# Altium schematic sheet 02_FPGA_Clock_Flash.SchDoc
size A
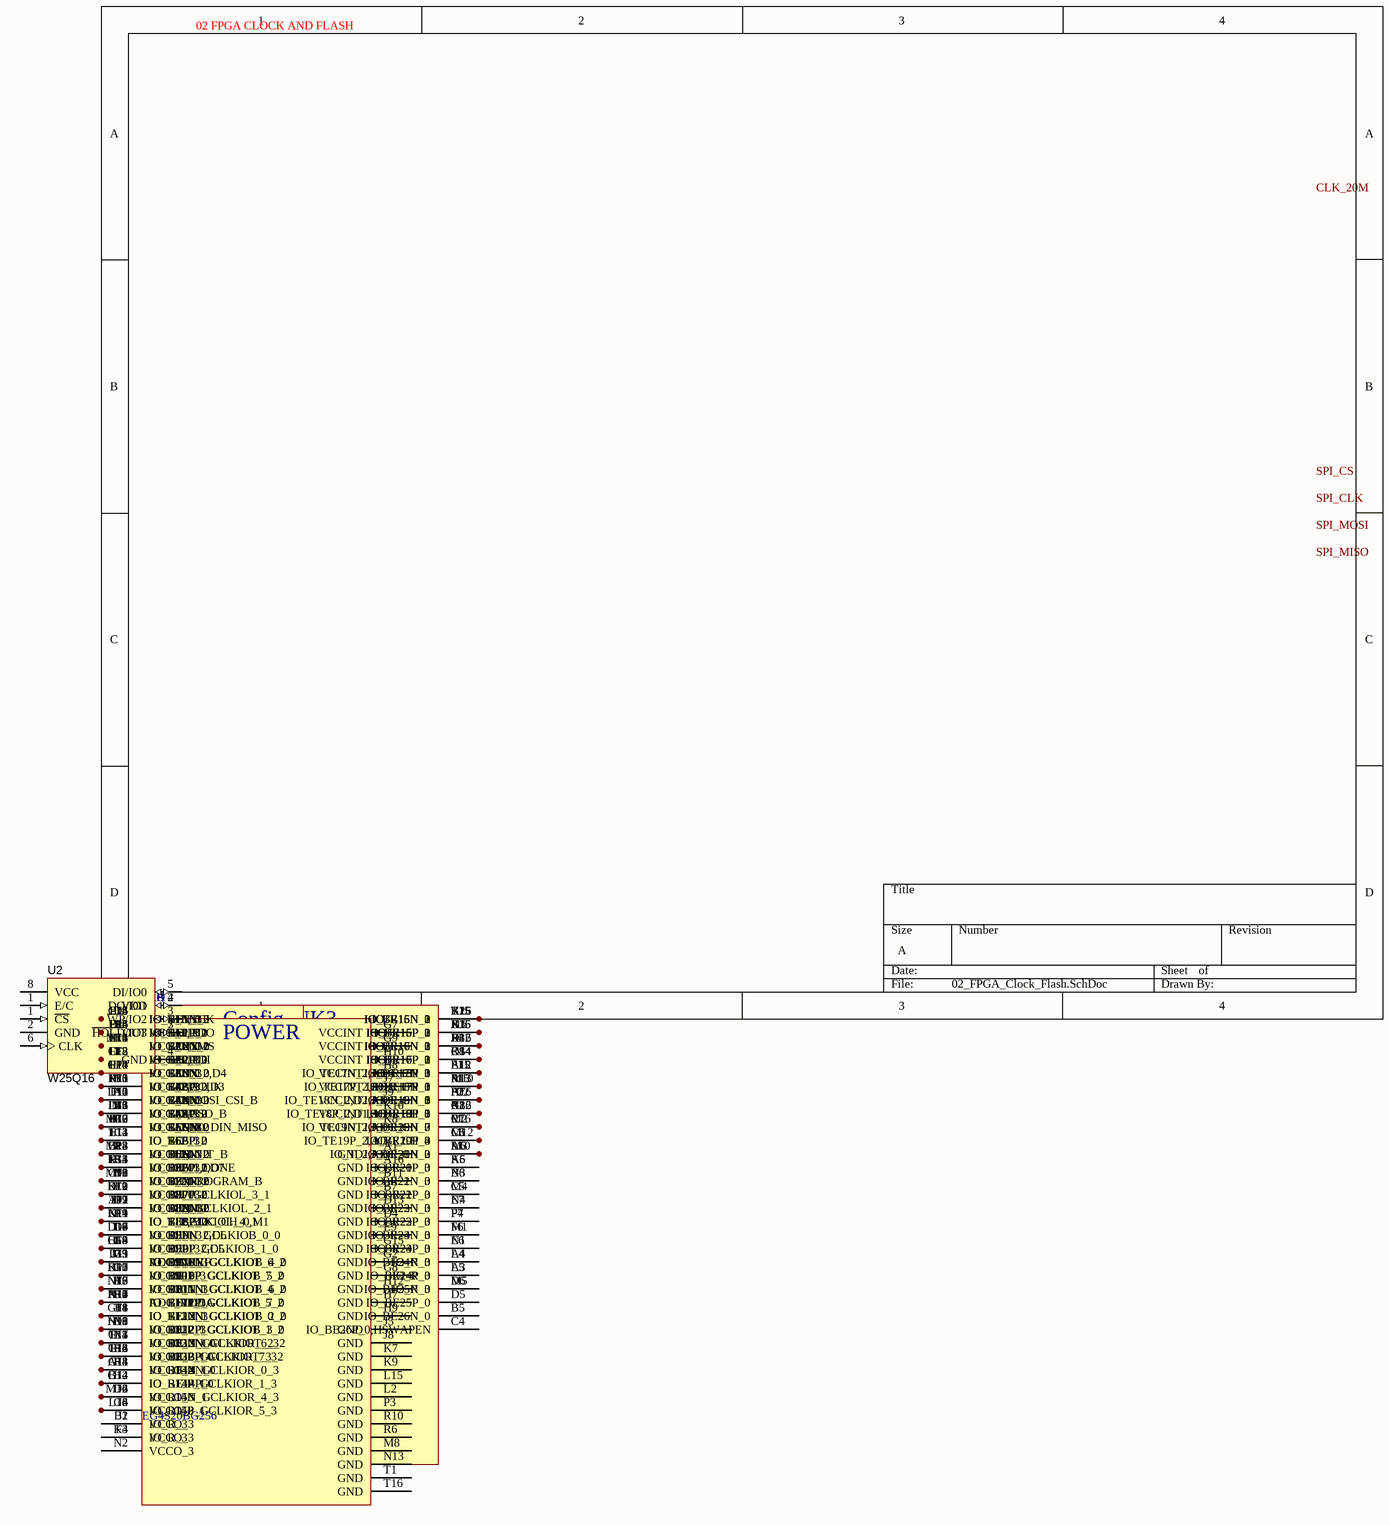
[diagram p0: 02_FPGA_Clock_Flash.SchDoc]

## Parts
U1  EG4S20BG256  [FBGA256]  (parts A,B,C,D,E,F of 6)
U2  W25Q16  [MICT-MW-8_N]
Y1  7X-50.000MBB-T  Frequency: 50MHz  [XTAL_NX3225SA]

## Nets
NetU1_A2: U1.A2(IO_R4N_3) U1.D12(IO_BE4N_0) U1.J10(VCCAUX) U1.J11(IO_L4N_1) U1.N6(IO_TE4N_2) U1.T10(IO_T_2,MOSI_CSI_B)
NetU1_A3: U1.A3(IO_BE24P_0) U1.L5(IO_R_3)
NetU1_A4: U1.A4(IO_BE24N_0) U1.L4(IO_R_3)
NetU1_A5: U1.A5(IO_BE20P_0) U1.K6(IO_R21P_3)
NetU1_A6: U1.A6(IO_BE20N_0) U1.L10(IO_T_2,ADC_CH_2) U1.M3(IO_R21N_3)
NetU1_A7: U1.A7(IO_BE18N_0) U1.H16(IO_L18N_1) U1.P2(IO_R19N_3) U1.P12(IO_TE18N_2,D2,ADC_CH_6)
NetU1_A8: U1.A8(IO_BE18P_0) U1.G16(IO_L18P_1) U1.N12(IO_TE18P_2,D1,ADC_CH_5) U1.R2(IO_R19P_3)
NetU1_A9: U1.A9(IO_BE11N_GCLKIOB_6_0) U1.H5(IO_R11N_3) U1.N15(VCCO_1) U1.N16(IO_L10N_1) U1.T7(IO_TE11N_GCLKIOT_4_2)
NetU1_A10: U1.A10(IO_BE11P_GCLKIOB_7_0) U1.H1(IO_R11P_3) U1.N14(IO_L10P_1) U1.R7(IO_TE11P_GCLKIOT_5_2) U1.R13(ADC_VDDA)
NetU1_A11: U1.A11(IO_BE8N_0) U1.D7(VCCO_0) U1.F2(IO_R8N_3) U1.J12(IO_L8N_GCLKIOL_2_1) U1.P9(IO_TE8N_2) U1.T11(IO_T_2,M0)
NetU1_A12: U1.A12(IO_BE17N_0) U1.E15(IO_L17N_1) U1.P1(IO_R18P_3) U1.P11(IO_TE17N_2,ADC_CH_3)
NetU1_A13: U1.A13(IO_BE17P_0) U1.F15(IO_L17P_1) U1.M10(IO_TE17P_2,ADC_CH_1) U1.R1(IO_R18N_3)
NetU1_A14: U1.A14(IO_BE14N_0) U1.G11(IO_L13N_1) U1.H3(IO_R14N_GCLKIOR_0_3) U1.R8(VCCO_2)
NetU1_A15: U1.A15(IO_L_1,TMS) U1.E4(IO_R2N_3) U1.E12(IO_BE2N_0) U1.F11(VCCAUX) U1.M11(IO_L2N_1) U1.T6(IO_TE2N_2)
NetU1_B1: U1.B1(IO_R_3) U1.J2(VCCO_3)
NetU1_B2: U1.B2(IO_R4P_3) U1.D11(IO_BE4P_0) U1.L6(VCCAUX) U1.L13(IO_L5P_1) U1.M6(IO_TE4P_2) U1.T3(IO_T_2,CSO_B)
NetU1_B3: U1.B3(IO_R1P_3) U1.E5(VCCAUX) U1.E14(IO_L_1,TDO) U1.E16(IO_BE1P_0) U1.P6(IO_TE1P_2) U1.P16(IO_L1P_1)
NetU1_B4: U1.B4(VCCO_0) U1.C1(IO_R6P_3) U1.E13(IO_BE6P_0) U1.K15(IO_L7P_1) U1.P13(IO_L3P_1,DONE) U1.R5(IO_TE6P_2,D7)
NetU1_B6: U1.B6(IO_BE21N_0) U1.N3(IO_R22N_3)
NetU1_B8: U1.B8(IO_BE16N_0) U1.D16(IO_L16N_1) U1.J6(IO_R17N_3) U1.R12(IO_TE16N_2)
NetU1_B9: U1.B9(VCCO_0) U1.C10(IO_BE7N_0) U1.D1(IO_R7N_3) U1.M15(IO_L7N_1) U1.N8(IO_TE7N_2) U1.T2(IO_T_2,PROGRAM_B)
NetU1_B10: U1.B10(IO_BE10P_GCLKIOB_5_0) U1.G1(IO_R10P_3) U1.H13(IO_L9P_1) U1.K13(VCCO_1) U1.P7(IO_TE10P_GCLKIOT_7_2)
NetU1_B12: U1.B12(IO_BE7P_0) U1.D10(VCCO_0) U1.E1(IO_R7P_3) U1.K12(IO_L8P_GCLKIOL_3_1) U1.T9(IO_TE7P_2)
NetU1_B13: U1.B13(VCCO_0) U1.C13(IO_BE6N_0) U1.E2(IO_R6N_3) U1.M14(IO_L6N_1) U1.P8(IO_TE6N_2) U1.R3(IO_T_2,INIT_B)
NetU1_B14: U1.B14(IO_BE14P_0) U1.G12(IO_L13P_1) U1.H4(IO_R14P_GCLKIOR_1_3)
NetU1_B15: U1.B15(IO_BE15N_0) U1.K2(IO_R16N_3) U1.K16(IO_L15N_1) U1.T15(IO_TE15N_2)
NetU1_B16: U1.B16(IO_BE15P_0) U1.J16(IO_L15P_1) U1.K3(IO_R16P_3) U1.R15(IO_TE15P_2)
NetU1_C2: U1.C2(IO_R5N_3) U1.E10(IO_BE5N_0) U1.L9(VCCAUX) U1.M7(IO_TE5N_2) U1.M13(IO_L5N_1) U1.P10(IO_T_2,D0_DIN_MISO)
NetU1_C3: U1.C3(IO_R5P_3) U1.E11(IO_BE5P_0) U1.L14(IO_L6P_1) U1.T12(IO_TE5P_2)
NetU1_C5: U1.C5(IO_BE21P_0) U1.M4(IO_R22P_3)
NetU1_C6: U1.C6(IO_BE19P_0) U1.L3(IO_R20P_3) U1.M12(IO_TE19P_2,ADC_CH_4)
NetU1_C7: U1.C7(IO_BE19N_0) U1.M2(IO_R20N_3) U1.R16(IO_TE19N_2,ADC_CH_7)
NetU1_C8: U1.C8(IO_BE16P_0) U1.D14(IO_L16P_1) U1.K5(IO_R17P_3) U1.R14(IO_TE16P_2)
NetU1_C9: U1.C9(IO_BE10N_GCLKIOB_4_0) U1.G3(IO_R10N_3) U1.J13(IO_L9N_1) U1.J15(VCCO_1) U1.L11(ADC_VREF) U1.M9(IO_TE10N_GCLKIOT_6_2)
NetU1_C11: U1.C11(IO_BE8P_0) U1.F1(IO_R8P_3) U1.K14(IO_L_GCLKIOL_4_1) U1.N11(IO_T_2,ADC_CH_0,M1) U1.R9(IO_TE8P_2)
NetU1_C12: U1.C12(IO_B_0,TDI) U1.E3(IO_R2P_3) U1.F8(VCCAUX) U1.F12(IO_BE2P_0) U1.L12(IO_L2P_1) U1.T5(IO_TE2P_2)
NetU1_C14: U1.C14(IO_B_0,TCK) U1.D3(IO_R1N_3) U1.F16(IO_BE1N_0) U1.P15(IO_L1N_1) U1.T4(IO_TE1N_2)
NetU1_C15: U1.C15(IO_BE13N_0) U1.F14(IO_L12N_1) U1.L1(IO_R13N_GCLKIOR_6_3) U1.N7(VCCO_2) U1.T13(IO_TE13N_GCLKIOT_2_2)
NetU1_C16: U1.C16(IO_BE13P_0) U1.F13(IO_L12P_1) U1.H2(IO_R13P_GCLKIOR_7_3) U1.R4(VCCO_2) U1.T14(IO_TE13P_GCLKIOT_3_2)
NetU1_D2: U1.D2(VCCO_3) U1.J4(IO_R15N_GCLKIOR_4_3) U1.M16(IO_L14N_1)
NetU1_D6: U1.D6(IO_BE25N_0) U1.M5(IO_R_3)
NetU1_D8: U1.D8(IO_BE12P_GCLKIOB_3_0) U1.H15(IO_L11P_1) U1.K1(IO_R12P_3) U1.N9(IO_TE12P_GCLKIOT_1_2) U1.N10(VCCO_2)
NetU1_D9: U1.D9(IO_BE9N_GCLKIOB_0_0) U1.D15(VCCO_1) U1.G6(IO_R9N_3) U1.J14(IO_L_1) U1.L7(IO_TE9N_2,D6)
NetU1_E6: U1.E6(IO_BE23P_0) U1.N1(IO_R24P_3)
NetU1_E7: U1.E7(IO_BE22N_0) U1.N4(IO_R23N_3)
NetU1_E8: U1.E8(IO_BE12N_GCLKIOB_2_0) U1.G14(IO_L11N_1) U1.J1(IO_R12N_3) U1.T8(IO_TE12N_GCLKIOT_0_2)
NetU1_F3: U1.F3(IO_R_3) U1.K4(VCCO_3)
NetU1_F4: U1.F4(IO_R3N_3) U1.G10(VCCAUX) U1.H11(IO_BE3N_0) U1.P5(IO_TE3N_2,D4) U1.P14(IO_L3N_1)
NetU1_F5: U1.F5(IO_R3P_3) U1.F10(IO_BE3P_0) U1.H6(VCCAUX) U1.K11(IO_L4P_1) U1.N5(IO_TE3P_2,D3) U1.R11(IO_T_2,CCLK)
NetU1_F6: U1.F6(IO_BE23N_0) U1.M1(IO_R24N_3)
NetU1_F7: U1.F7(IO_BE22P_0) U1.P4(IO_R23P_3)
NetU1_F9: U1.F9(IO_BE9P_GCLKIOB_1_0) U1.G5(IO_R9P_3) U1.G13(VCCO_1) U1.H14(IO_L_1) U1.L8(IO_TE9P_2,D5)
NetU1_G4: U1.G4(VCCO_3) U1.J3(IO_R15P_GCLKIOR_5_3) U1.L16(IO_L14P_1)
NetU2_2: U2.2(DO/IO1) Y1.4(VDD)
NetU2_7: U2.7(~{HOLD}/IO3) Y1.3(OUT)

Not connected (* = marked no-connect by the designer): U1 A1(GND) A16(GND) B5(IO_BE26N_0) B7(GND) B11(GND) C4(IO_BE26P_0,HSWAPEN) D4(GND) D5(IO_BE25P_0) D13(GND) E9(GND) G2(GND) G7(VCCINT) G8(GND) G9(VCCINT) G15(GND) H7(GND) H8(VCCINT) H9(GND) H10(VCCINT) H12(GND) J5(GND) J7(VCCINT) J8(GND) J9(VCCINT) K7(GND) K8(VCCINT) K9(GND) K10(VCCINT) L2(GND) L15(GND) M8(GND) N2(VCCO_3) N13(GND) P3(GND) R6(GND) R10(GND) T1(GND) T16(GND); U2 1(~{CS}) 3(~{WP}/IO2) 4(GND) 5(DI/IO0) 6(CLK) 8(VCC); Y1 1(E/C) 2(GND)

## Notes on the sheet
- 02 FPGA CLOCK AND FLASH
- Labels drawn without touching a wire or pin: CLK_20M, SPI_CLK, SPI_CS, SPI_MISO, SPI_MOSI
- (in symbol EG4S20BG256, part A) BANK0
- (in symbol EG4S20BG256, part B) BANK1
- (in symbol EG4S20BG256, part C) BANK2
- (in symbol EG4S20BG256, part D) BANK3
- (in symbol EG4S20BG256, part E) Config
- (in symbol EG4S20BG256, part F) POWER

## Library data of the parts
U2 = W25Q80BLSNIG: 2.5V 8M-Bit Serial Flash Memory with Dual and Quad SPI, SOIC-8; Manufacturer: Winbond; SymbolCreator: Altium; SymbolVersion: 2015-04-01; PartNumber: W25Q16; MountType: SMT; ComponentLink1Description: Datasheet Link; ComponentLink1URL: http://www.winbond.com/resource-files/da00-w25q80blf1.pdf; RoHS: Y; PackageReference: SOIC-8; Publisher: Texas Instruments; LatestRevisionDate: 2015-05-05; Supplier 1: Digi-Key; Supplier Part Number 1: W25Q80BLSNIG-ND
Y1 = 7X-20.000MBB-T: Crystal, 有源晶振，Sealed Locked 50MHz, 15pF, SMD; Manufacturer: TXC Corporation; SymbolCreator: a0799628; CompType: Oscillator; U/M: EA; TaMin_C: -40; TaMax_C: 85; Frequency Stability: ?ppm; SymbolVersion: 2013-06-14; PartNumber: 7X-50.000MBB-T; PackageReference: 3.2x1x2.5 mm; MountType: SMT; RoHS: Y; ComponentLink1Description: Datasheet Link; ComponentLink1URL: http://www.txccrystal.com/images/pdf/7x.pdf; Publisher: Texas Instruments; LatestRevisionDate: 2013-06-18; LatestRevisionNote: Changed publisher; Supplier 1: Digi-Key; Supplier Part Number 1: 887-1217-1-ND; Supplier 2: Mouser; Supplier Part Number 2: 717-7X-20.000MBB-T; Supplier 3: Farnell; Supplier Part Number 3: 1842164